# Altium schematic sheet Sheet_1-copy_2025-07-01.schdoc
size 273 x 269 mm
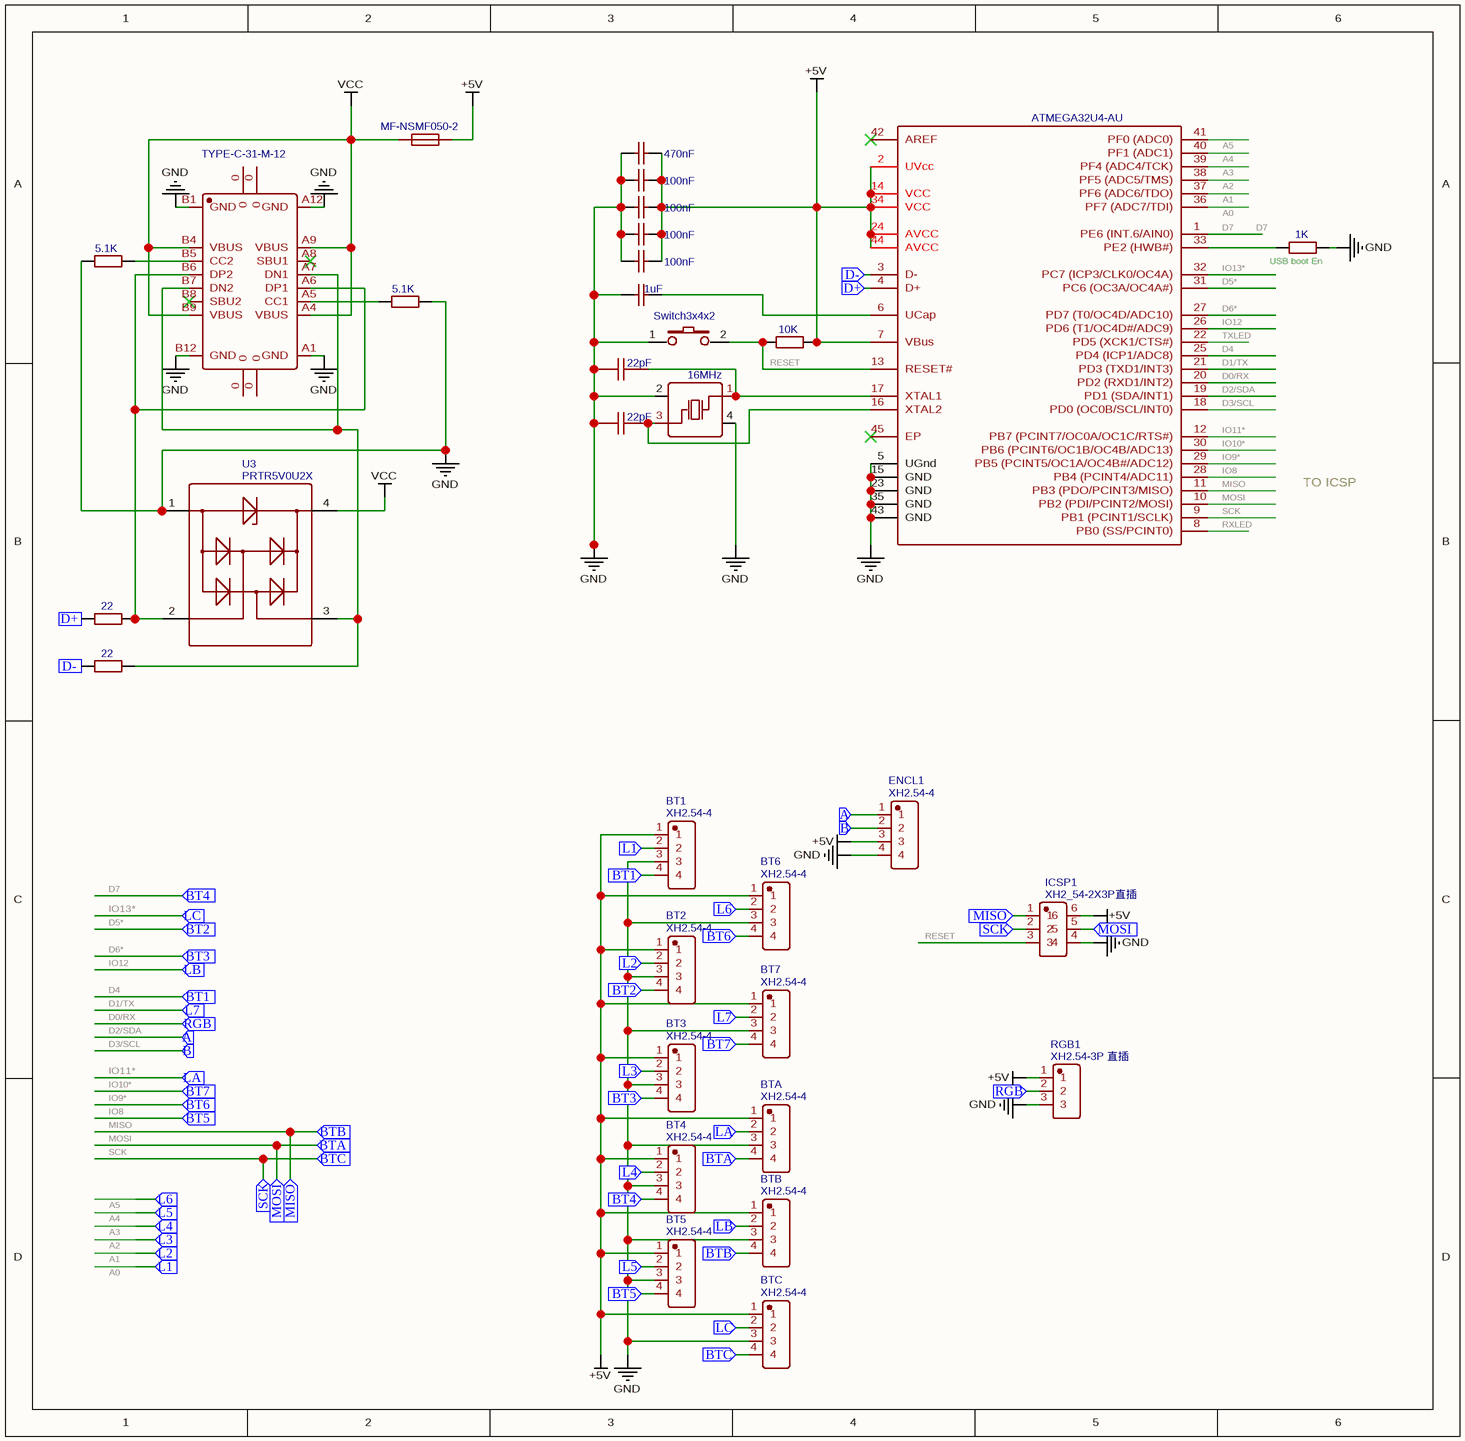
[diagram p0: Sheet_1-copy_2025-07-01.schdoc]

## Parts
BT1  XH2.54-4  [CONN-TH_XH2.54-4]
BT2  XH2.54-4  [CONN-TH_XH2.54-4]
BT3  XH2.54-4  [CONN-TH_XH2.54-4]
BT4  XH2.54-4  [CONN-TH_XH2.54-4]
BT5  XH2.54-4  [CONN-TH_XH2.54-4]
BT6  XH2.54-4  [CONN-TH_XH2.54-4]
BT7  XH2.54-4  [CONN-TH_XH2.54-4]
BTA  XH2.54-4  [CONN-TH_XH2.54-4]
BTB  XH2.54-4  [CONN-TH_XH2.54-4]
BTC  XH2.54-4  [CONN-TH_XH2.54-4]
C9  22pF  [C0603]
C10  22pF  [C0603]
C11  100nF  [C0603]
C12  100nF  [C0603]
C13  100nF  [C0603]
C14  100nF  [C0603]
C15  470nF  [C0603]
C16  1uF  [C0603]
ENCL1  XH2.54-4  [CONN-TH_XH2.54-4]
ICSP1  XH2_54-2X3P直插  [CONN-TH_XH2.54-2X3P]
KEY2  Switch3x4x2  [KEY-3.0*4.0]
R1  10K  [R0805]
R2  1K  [R0805]
R3  5.1K  [R0805]
R4  5.1K  [R0805]
R5  22  [R0603]
R6  22  [R0603]
RGB1  XH2.54-3P 直插  [CONN-TH_XH2.54-3P]
U2  MF-NSMF050-2  [F1206]
U3  PRTR5V0U2X  [SOT-143_L2.9-W1.3-P1.92-LS2.3-BL]
U77  ATMEGA32U4-AU  [QFP-44_L10.0-W10.0-P0.80-LS13.2-BL]
USBC2  TYPE-C-31-M-12  [USB-C_SMD-TYPE-C-31-M-12]
X1  16MHz  [OSC-SMD_4P-L3.2-W2.5-BL]

## Ports
A (in), B (in), BT1 (in), BT2 (in), BT3 (in), BT4 (in), BT5 (in), BT6 (in), BT7 (in), BTA (in), BTB (in), BTC (in), D+ (in), D- (in), L1 (in), L2 (in), L3 (in), L4 (in), L5 (in), L6 (in), L7 (in), LA (in), LB (in), LC (in), MISO (in), MOSI (in), RGB (in), SCK (in)

## Nets
+5V: BT1.1 BT2.1 BT3.1 BT4.1 BT5.1 BT6.1 BT7.1 BTA.1 BTB.1 BTC.1 C11.2 C12.2 C13.2 C14.2 C15.2 ENCL1.3 ICSP1.6 R1.2 RGB1.1 U2.2 U77.2(UVcc) U77.7(VBus) U77.14(VCC) U77.24(AVCC) U77.34(VCC) U77.44(AVCC)
GND: BT1.3 BT2.3 BT3.3 BT4.3 BT5.3 BT6.3 BT7.3 BTA.3 BTB.3 BTC.3 C9.1 C10.1 C11.1 C12.1 C13.1 C14.1 C15.1 C16.1 ENCL1.4 ICSP1.4 KEY2.1 R2.2 R3.2 R4.1 RGB1.3 U3.1(GND) U77.5(UGnd) U77.15(GND) U77.23(GND) U77.35(GND) U77.43(GND) USBC2.A1(GND) USBC2.A12(GND) USBC2.B1(GND) USBC2.B12(GND) X1.2(GND) X1.4(GND)
VCC: U2.1 U3.4(VCC) USBC2.A4(VBUS) USBC2.A9(VBUS) USBC2.B4(VBUS) USBC2.B9(VBUS)
A0: BT1.2 U77.36(PF7_(ADC7/TDI)) ; port L1
A1: BT2.2 U77.37(PF6_(ADC6/TDO)) ; port L2
A2: BT3.2 U77.38(PF5_(ADC5/TMS)) ; port L3
A3: BT4.2 U77.39(PF4_(ADC4/TCK)) ; port L4
A4: BT5.2 U77.40(PF1_(ADC1)) ; port L5
A5: BT6.2 U77.41(PF0_(ADC0)) ; port L6
D0/RX: RGB1.2 U77.20(PD2_(RXD1/INT2)) ; port RGB
D1/TX: BT7.2 U77.21(PD3_(TXD1/INT3)) ; port L7
D2/SDA: ENCL1.1 U77.19(PD1_(SDA/INT1)) ; port A
D3/SCL: ENCL1.2 U77.18(PD0_(OC0B/SCL/INT0)) ; port B
D4: BT1.4 U77.25(PD4_(ICP1/ADC8)) ; port BT1
D5*: BT2.4 U77.31(PC6_(OC3A/OC4A#)) ; port BT2
D6*: BT3.4 U77.27(PD7_(T0/OC4D/ADC10)) ; port BT3
D7: BT4.4 U77.1(PE6_(INT.6/AIN0)) ; port BT4
D+: R5.1 U77.4(D+) ; port D+
D-: R6.1 U77.3(D-) ; port D-
IO8: BT5.4 U77.28(PB4_(PCINT4/ADC11)) ; port BT5
IO9*: BT6.4 U77.29(PB5_(PCINT5/OC1A/OC4B#/ADC12)) ; port BT6
IO10*: BT7.4 U77.30(PB6_(PCINT6/OC1B/OC4B/ADC13)) ; port BT7
IO11*: BTA.2 U77.12(PB7_(PCINT7/OC0A/OC1C/RTS#)) ; port LA
IO12: BTB.2 U77.26(PD6_(T1/OC4D#/ADC9)) ; port LB
IO13*: BTC.2 U77.32(PC7_(ICP3/CLK0/OC4A)) ; port LC
MISO: BTB.4 ICSP1.1 U77.11(PB3_(PDO/PCINT3/MISO)) ; port MISO, port BTB
MOSI: BTA.4 ICSP1.5 U77.10(PB2_(PDI/PCINT2/MOSI)) ; port MOSI, port BTA
RESET: ICSP1.3 KEY2.2 R1.1 U77.13(RESET#)
RXLED: U77.8(PB0_(SS/PCINT0))
SCK: BTC.4 ICSP1.2 U77.9(PB1_(PCINT1/SCLK)) ; port SCK, port BTC
TXLED: U77.22(PD5_(XCK1/CTS#))
NetC9_2: C9.2 U77.17(XTAL1) X1.1(OSC1)
NetC10_2: C10.2 U77.16(XTAL2) X1.3(OSC2)
NetC16_2: C16.2 U77.6(UCap)
NetR2_1: R2.1 U77.33(PE2_(HWB#))
NetR3_1: R3.1 USBC2.A5(CC1)
NetR4_2: R4.2 USBC2.B5(CC2)
NetR5_2: R5.2 U3.2(IO1) USBC2.A6(DP1) USBC2.B6(DP2)
NetR6_2: R6.2 U3.3(IO2) USBC2.A7(DN1) USBC2.B7(DN2)

Not connected (* = marked no-connect by the designer): U77 42(AREF)* 45(EP)*; USBC2 0 A8(SBU1)* B8(SBU2)*

## Notes on the sheet
- (near R2) USB boot En
- TO ICSP

## Library data of the parts
BT1-BT5 BT7 BTA BTB BTC ENCL1 = XH2.54-4: Manufacturer: null; Contributor: LCSC; Supplier: LCSC; Supplier Part: C9900012082; Manufacturer Part: XH2.54-4; JLCPCB Part Class: Extended Part; link: https://so.szlcsc.com/global.html?k=C9900012082&ref=editor; spicePre: U; spiceSymbolName: XH2.54-4
BT6 = XH2.54-4: Manufacturer: null; Contributor: LCSC; Package Display: No; Supplier: LCSC; Supplier Part: C9900012082; Manufacturer Part: XH2.54-4; JLCPCB Part Class: Extended Part; link: https://so.szlcsc.com/global.html?k=C9900012082&ref=editor; spicePre: U; spiceSymbolName: XH2.54-4
C9 C10 = 22pF: Manufacturer: SAMSUNG; Manufacturer Part: CL10C220JB81PNC; nameAlias: Capacitance; Contributor: LCSC; SMT Type: Extend; Supplier: LCSC; Supplier Part: C170132; LCSC Assembly: Yes; spicePre: C; spiceSymbolName: CL10C220JB81PNC
C11-C14 = 100nF: Manufacturer Part: CL10B104JB8NNNC; Manufacturer: SAMSUNG; nameAlias: Capacitance; SMT Type: Extend; Supplier: LCSC; Supplier Part: C24452; LCSC Assembly: Yes; spicePre: C; spiceSymbolName: CL10B104JB8NNNC
C15 = 470nF: Manufacturer Part: CL10B474KA8NNNC; Manufacturer: SAMSUNG; nameAlias: Capacitance; SMT Type: Basic; Supplier: LCSC; LCSC Assembly: Yes; Supplier Part: C1623; spicePre: C; spiceSymbolName: CL10B474KA8NNNC
C16 = 1uF: Manufacturer Part: CL10A105KB8NNNC; Manufacturer: SAMSUNG; nameAlias: Capacitance; SMT Type: Basic; Supplier: LCSC; LCSC Assembly: Yes; Supplier Part: C15849; spicePre: C; spiceSymbolName: CL10A105KB8NNNC
ICSP1 = XH2_54-2X3P直插: Manufacturer: null; Contributor: LCSC; Supplier: LCSC; Supplier Part: C9900001046; Manufacturer Part: XH2_54-2X3P直插; JLCPCB Part Class: Extended Part; link: https://so.szlcsc.com/global.html?k=C9900001046&ref=editor; spicePre: U; spiceSymbolName: XH2_54-2X3P直插
KEY2 = Switch3x4x2: Manufacturer: ReliaPro; Supplier: LCSC; Manufacturer Part: Switch3x4x2; Supplier Part: C26638; spicePre: K; spiceSymbolName: Switch3x4x2
R1 = 10K: Manufacturer: UniOhm; Manufacturer Part: 0805W8F1002T5E; nameAlias: Resistance (Ohms); SMT Type: Basic; Supplier: LCSC; LCSC Assembly: Yes; Supplier Part: C17414; spicePre: R; spiceSymbolName: 0805W8F1002T5E
R2 = 1K: Manufacturer: UniOhm; Manufacturer Part: TC0525F1001T5E; nameAlias: Resistance (Ohms); SMT Type: Extend; Supplier: LCSC; Supplier Part: C75781; LCSC Assembly: Yes; spicePre: R; spiceSymbolName: TC0525F1001T5E
R3 R4 = 5.1K: Manufacturer: UniOhm; Manufacturer Part: 0805W8F5101T5E; nameAlias: Resistance (Ohms); SMT Type: Basic; Supplier: LCSC; LCSC Assembly: Yes; Supplier Part: C27834; spicePre: R; spiceSymbolName: 0805W8F5101T5E
R5 R6 = 22: Manufacturer: UniOhm; Manufacturer Part: 0603WAF220JT5E; nameAlias: Resistance (Ohms); SMT Type: Basic; Supplier: LCSC; LCSC Assembly: Yes; Supplier Part: C23345; spicePre: R; spiceSymbolName: 0603WAF220JT5E
RGB1 = XH2.54-3P 直插: Manufacturer: null; Contributor: LCSC; Supplier: LCSC; Supplier Part: C9900000727; Manufacturer Part: XH2.54-3P 直插; JLCPCB Part Class: Extended Part; link: https://so.szlcsc.com/global.html?k=C9900000727&ref=editor; spicePre: U; spiceSymbolName: XH2.54-3P 直插
U2 = MF-NSMF050-2: Manufacturer: BOURNS; SMT Type: Extend; Supplier: LCSC; Manufacturer Part: MF-NSMF050-2; Supplier Part: C75464; LCSC Assembly: Yes; spicePre: U; spiceSymbolName: MF-NSMF050-2
U3 = PRTR5V0U2X: Manufacturer: Yenji Elec; Contributor: LCSC; Supplier: LCSC; Supplier Part: C330092; Manufacturer Part: PRTR5V0U2X; spicePre: D; spiceSymbolName: PRTR5V0U2X
U77 = ATMEGA32U4-AU: Manufacturer: MICROCHIP; Manufacturer Part: ATMEGA32U4-MU; Supplier: LCSC; Supplier Part: C112161; spicePre: U; spiceSymbolName: ATMEGA32U4-MU
USBC2 = TYPE-C-31-M-12: Manufacturer: Rectangular Connectors - Contacts; Contributor: LCSC; Supplier: LCSC; Supplier Part: C165948; Manufacturer Part: TYPE-C-31-M-12; spicePre: U; spiceSymbolName: TYPE-C-31-M-12
X1 = 16MHz: Manufacturer: YXC; Manufacturer Part: X322516MRB4SI; nameAlias: Frequency; SMT Type: Extend; Supplier: LCSC; Supplier Part: C70562; LCSC Assembly: Yes; spicePre: X; spiceSymbolName: X322516MRB4SI